# Altium schematic sheet lcd.SchDoc
size A4; SheetNumber: 5; SheetTotal: 8
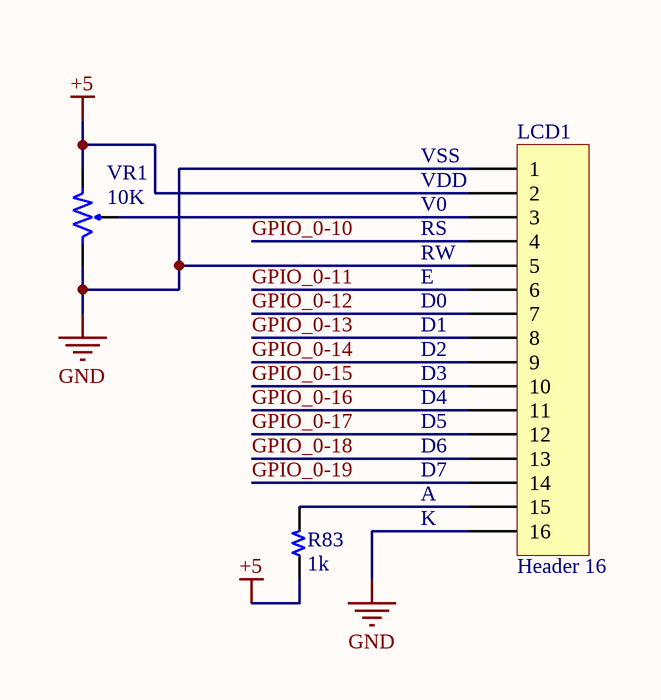
[diagram p0: lcd.SchDoc]

## Parts
LCD1  Header 16  [HDR1X16]
R83  1k  [R 0603]
VR1  10K  [VR1]

## Nets
+5: LCD1.2 R83.1 VR1.1
GND: LCD1.1 LCD1.5 LCD1.16 VR1.3
GPIO_0-10: LCD1.4
GPIO_0-11: LCD1.6
GPIO_0-12: LCD1.7
GPIO_0-13: LCD1.8
GPIO_0-14: LCD1.9
GPIO_0-15: LCD1.10
GPIO_0-16: LCD1.11
GPIO_0-17: LCD1.12
GPIO_0-18: LCD1.13
GPIO_0-19: LCD1.14
NetLCD1_3: LCD1.3 VR1.2
NetLCD1_15: LCD1.15 R83.2

## Notes on the sheet
- (near LCD1) VSS
- (near LCD1) VDD
- (near LCD1) V0
- (near LCD1) RS
- (near LCD1) RW
- (near LCD1) E
- (near LCD1) D0
- (near LCD1) D1
- (near LCD1) D2
- (near LCD1) D3
- (near LCD1) D4
- (near LCD1) D5
- (near LCD1) D6
- (near LCD1) D7
- A
- K

## Library data of the parts
LCD1 = Header 16: Header, 16-Pin; LatestRevisionDate: 17-Jul-2002; LatestRevisionNote: Re-released for DXP Platform.; Publisher: Altium Limited
R83 = Resistor
VR1 = VR1: Var Resistor; Value: VR 10K